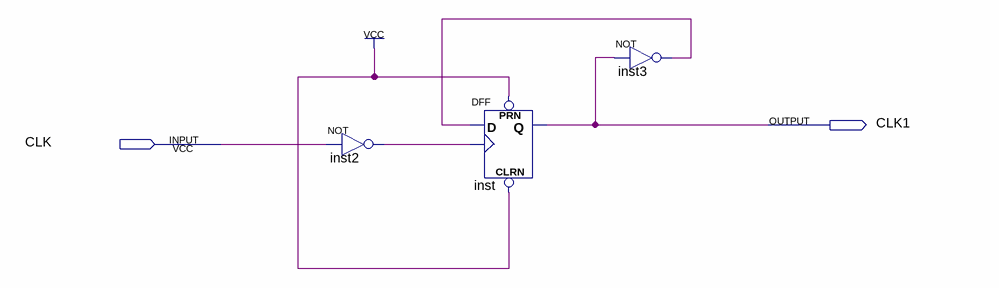
[diagram p0: schematic sheet]
// Quartus schematic lab.bdf as structural Verilog: 3 symbols, 2 pins
module lab (
  input  CLK,
  output CLK1
);

  wire inst2_out, inst3_out;

  not inst2 (inst2_out, CLK);
  DFF inst (.CLRN(1'b1), .CLK(inst2_out), .D(inst3_out), .PRN(1'b1), .Q(CLK1));
  not inst3 (inst3_out, CLK1);
endmodule
